# Altium schematic sheet Tunable_Capacitance.SchDoc
size A4; SheetNumber: 3; SheetTotal: 6
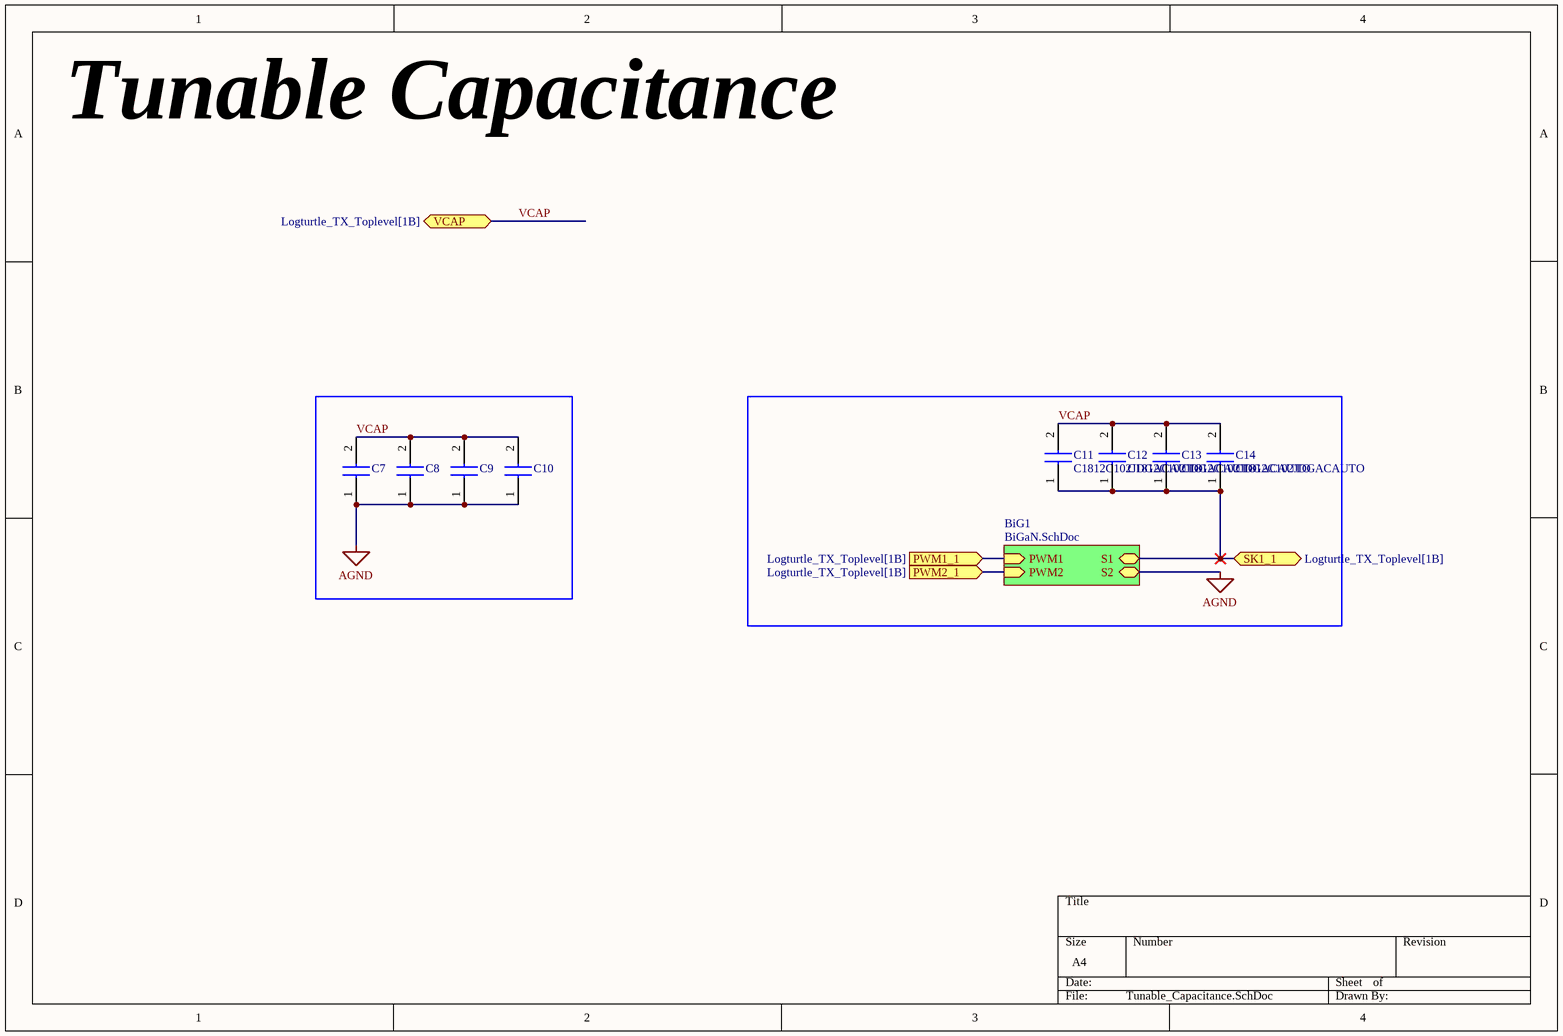
[diagram p0: Tunable_Capacitance.SchDoc]

## Parts
C7  C1812C102JDGACAUTO  [C1812]  (value not drawn)
C8  C1812C102JDGACAUTO  [C1812]  (value not drawn)
C9  C1812C102JDGACAUTO  [C1812]  (value not drawn)
C10  C1812C102JDGACAUTO  [C1812]  (value not drawn)
C11  C1812C102JDGACAUTO  [C1812]
C12  C1812C102JDGACAUTO  [C1812]
C13  C1812C102JDGACAUTO  [C1812]
C14  C1812C102JDGACAUTO  [C1812]

## Sub-sheets
BiG1 = BiGaN.SchDoc: PWM1 (in), PWM2 (in), S1 (bidir), S2 (bidir)

## Ports
PWM1_1 (in, see Logturtle_TX_Toplevel[1B]), PWM2_1 (in, see Logturtle_TX_Toplevel[1B]), SK1_1 (bidir, see Logturtle_TX_Toplevel[1B]), VCAP (bidir, see Logturtle_TX_Toplevel[1B])

## Nets
AGND: C7.1 C8.1 C9.1 C10.1 ; sheet BiG1/S2
PWM1_1: port PWM1_1, sheet BiG1/PWM1
PWM2_1: port PWM2_1, sheet BiG1/PWM2
SK1_1: C11.1 C12.1 C13.1 C14.1 ; port SK1_1, sheet BiG1/S1
VCAP: C7.2 C8.2 C9.2 C10.2 C11.2 C12.2 C13.2 C14.2 ; port VCAP

## Notes on the sheet
- Tunable Capacitance

## Library data of the parts
C7-C14 = C1812C102JDGACAUTO: Capacitor; Manufacturer_Name: YAGEO; Datasheet Link: https://content.kemet.com/datasheets/KEM_C1080_C0G_HV_AUTO_SMD.pdf; Height: 1.55mm; Manufacturer_Part_Number: C1812C102JDGACAUTO